# EAGLE schematic rs41 (EAGLE 9.6.2)

## Sheet 1 of 6: MCU
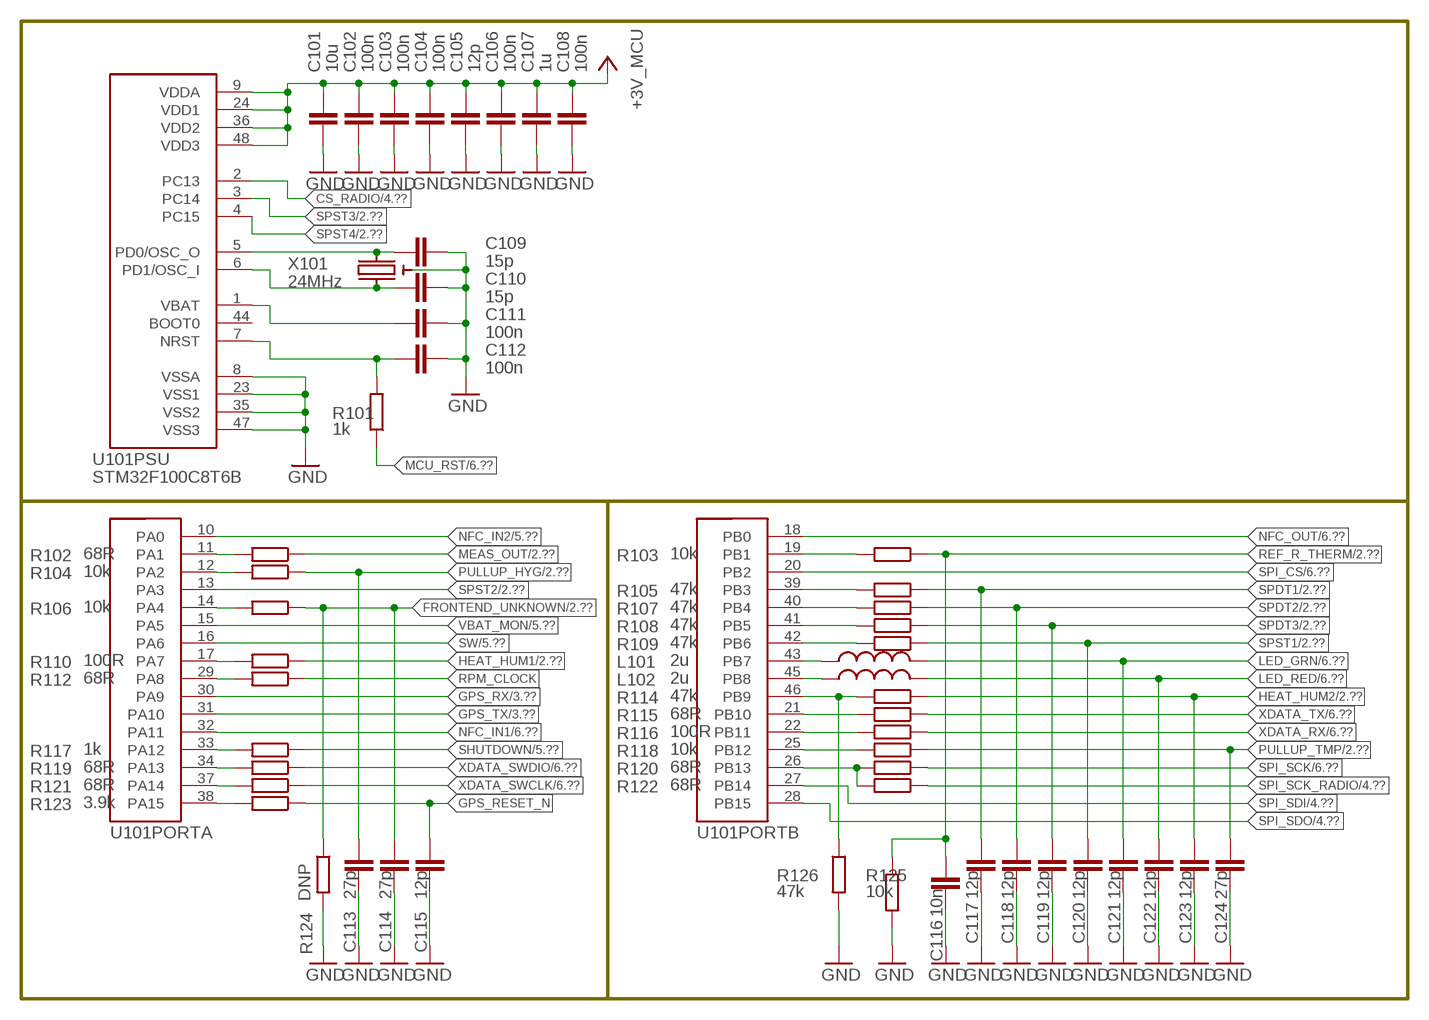
[diagram p0: schematic, sheet 1]

### Parts
C101  10u  C-EUC0603  [C0603]
C102  100n  C-EUC0402  [C0402]
C103  100n  C-EUC0402  [C0402]
C104  100n  C-EUC0402  [C0402]
C105  12p  C-EUC0402  [C0402]
C106  100n  C-EUC0402  [C0402]
C107  1u  C-EUC0402  [C0402]
C108  100n  C-EUC0402  [C0402]
C109  15p  C-EUC0402  [C0402]
C110  15p  C-EUC0402  [C0402]
C111  100n  C-EUC0402  [C0402]
C112  100n  C-EUC0402  [C0402]
C113  27p  C-EUC0402  [C0402]
C114  27p  C-EUC0402  [C0402]
C115  12p  C-EUC0402  [C0402]
C116  10n  C-EUC0402  [C0402]
C117  12p  C-EUC0402  [C0402]
C118  12p  C-EUC0402  [C0402]
C119  12p  C-EUC0402  [C0402]
C120  12p  C-EUC0402  [C0402]
C121  12p  C-EUC0402  [C0402]
C122  12p  C-EUC0402  [C0402]
C123  12p  C-EUC0402  [C0402]
C124  27p  C-EUC0402  [C0402]
L101  2u  L0402  [0402]
L102  2u  L0402  [0402]
R101  1k  R-EU_R0402  [R0402]
R102  68R  R-EU_R0402  [R0402]
R103  10k  R-EU_R0402  [R0402]
R104  10k  R-EU_R0402  [R0402]
R105  47k  R-EU_R0402  [R0402]
R106  10k  R-EU_R0402  [R0402]
R107  47k  R-EU_R0402  [R0402]
R108  47k  R-EU_R0402  [R0402]
R109  47k  R-EU_R0402  [R0402]
R110  100R  R-EU_R0402  [R0402]
R112  68R  R-EU_R0402  [R0402]
R114  47k  R-EU_R0402  [R0402]
R115  68R  R-EU_R0402  [R0402]
R116  100R  R-EU_R0402  [R0402]
R117  1k  R-EU_R0402  [R0402]
R118  10k  R-EU_R0402  [R0402]
R119  68R  R-EU_R0402  [R0402]
R120  68R  R-EU_R0402  [R0402]
R121  68R  R-EU_R0402  [R0402]
R122  68R  R-EU_R0402  [R0402]
R123  3.9k  R-EU_R0402  [R0402]
R124  DNP  R-EU_R0402  [R0402]
R125  10k  R-EU_R0402  [R0402]
R126  47k  R-EU_R0402  [R0402]
U101  STM32F100C8T6B  STM32F100C8LQFP48  [LQFP48]
X101  24MHz  OSC_MCU  [OSCCC650X400X120]

### Nets
+3V_MCU: C101.2 C102.2 C103.2 C104.2 C105.2 C106.2 C107.2 C108.2 U101.9(PSU:VDDA) U101.24(PSU:VDD1) U101.36(PSU:VDD2) U101.48(PSU:VDD3) ; also sheet 3,4,5,6
CS_RADIO: U101.2(PSU:PC13) ; also sheet 4
FRONTEND_UNKNOWN: C114.1 R106.1 R124.1 ; also sheet 2
GND: C101.1 C102.1 C103.1 C104.1 C105.1 C106.1 C107.1 C108.1 C109.2 C110.2 C111.2 C112.2 C113.2 C114.2 C115.2 C116.1 C117.1 C118.1 C119.1 C120.1 C121.1 C122.1 C123.1 C124.1 R124.2 R125.2 R126.2 U101.8(PSU:VSSA) U101.23(PSU:VSS1) U101.35(PSU:VSS2) U101.47(PSU:VSS3) X101.1(GND) X101.4(GND) ; also sheet 2,3,4,5,6
GPS_RESET_N: C115.1 R123.1
GPS_RX: U101.30(PORTA:PA9) ; also sheet 3
GPS_TX: U101.31(PORTA:PA10) ; also sheet 3
HEAT_HUM1: R110.1 ; also sheet 2
HEAT_HUM2: C123.2 R114.1 ; also sheet 2
LED_GRN: C121.2 L101.2 ; also sheet 6
LED_RED: C122.2 L102.2 ; also sheet 6
MCU_RST: R101.1 ; also sheet 6
MEAS_OUT: R102.1 ; also sheet 2
N$78: R121.2 U101.37(PORTA:PA14)
N$79: R119.2 U101.34(PORTA:PA13)
N$88: R117.2 U101.33(PORTA:PA12)
N$89: R112.2 U101.29(PORTA:PA8)
N$90: R110.2 U101.17(PORTA:PA7)
N$92: R102.2 U101.11(PORTA:PA1)
N$95: R104.2 U101.12(PORTA:PA2)
N$97: R123.2 U101.38(PORTA:PA15)
N$98: R106.2 U101.14(PORTA:PA4)
N$106: R115.2 U101.21(PORTB:PB10)
N$107: R116.2 U101.22(PORTB:PB11)
N$110: R118.2 U101.25(PORTB:PB12)
N$112: R120.2 R122.2 U101.26(PORTB:PB13)
N$115: R114.2 R126.1 U101.46(PORTB:PB9)
N$117: L102.1 U101.45(PORTB:PB8)
N$119: L101.1 U101.43(PORTB:PB7)
N$121: R109.2 U101.42(PORTB:PB6)
N$123: R108.2 U101.41(PORTB:PB5)
N$125: R107.2 U101.40(PORTB:PB4)
N$127: R105.2 U101.39(PORTB:PB3)
N$130: R103.2 U101.19(PORTB:PB1)
N$141: C109.1 U101.5(PSU:PD0/OSC_O) X101.2(XIN)
N$142: C110.1 U101.6(PSU:PD1/OSC_I) X101.3(XOUT)
N$143: C111.1 U101.1(PSU:VBAT)
N$144: C112.1 R101.2 U101.7(PSU:NRST)
NFC_IN1: U101.32(PORTA:PA11) ; also sheet 6
NFC_IN2: U101.10(PORTA:PA0) ; also sheet 5
NFC_OUT: U101.18(PORTB:PB0) ; also sheet 6
PULLUP_HYG: C113.1 R104.1 ; also sheet 2
PULLUP_TMP: C124.2 R118.1 ; also sheet 2
REF_R_THERM: C116.2 R103.1 R125.1 ; also sheet 2
RPM_CLOCK: R112.1
SHUTDOWN: R117.1 ; also sheet 5
SPDT1: C117.2 R105.1 ; also sheet 2
SPDT2: C118.2 R107.1 ; also sheet 2
SPDT3: C119.2 R108.1 ; also sheet 2
SPI_CS: U101.20(PORTB:PB2) ; also sheet 6
SPI_SCK: R120.1 ; also sheet 6
SPI_SCK_RADIO: R122.1 ; also sheet 4
SPI_SDI: U101.27(PORTB:PB14) ; also sheet 4,6
SPI_SDO: U101.28(PORTB:PB15) ; also sheet 4,6
SPST1: C120.2 R109.1 ; also sheet 2
SPST2: U101.13(PORTA:PA3) ; also sheet 2
SPST3: U101.3(PSU:PC14) ; also sheet 2
SPST4: U101.4(PSU:PC15) ; also sheet 2
SW: U101.16(PORTA:PA6) ; also sheet 5
VBAT_MON: U101.15(PORTA:PA5) ; also sheet 5
XDATA_RX: R116.1 ; also sheet 6
XDATA_SWCLK: R121.1 ; also sheet 6
XDATA_SWDIO: R119.1 ; also sheet 6
XDATA_TX: R115.1 ; also sheet 6
Unconnected: U101.44(PSU:BOOT0)

## Sheet 2 of 6: Frontend
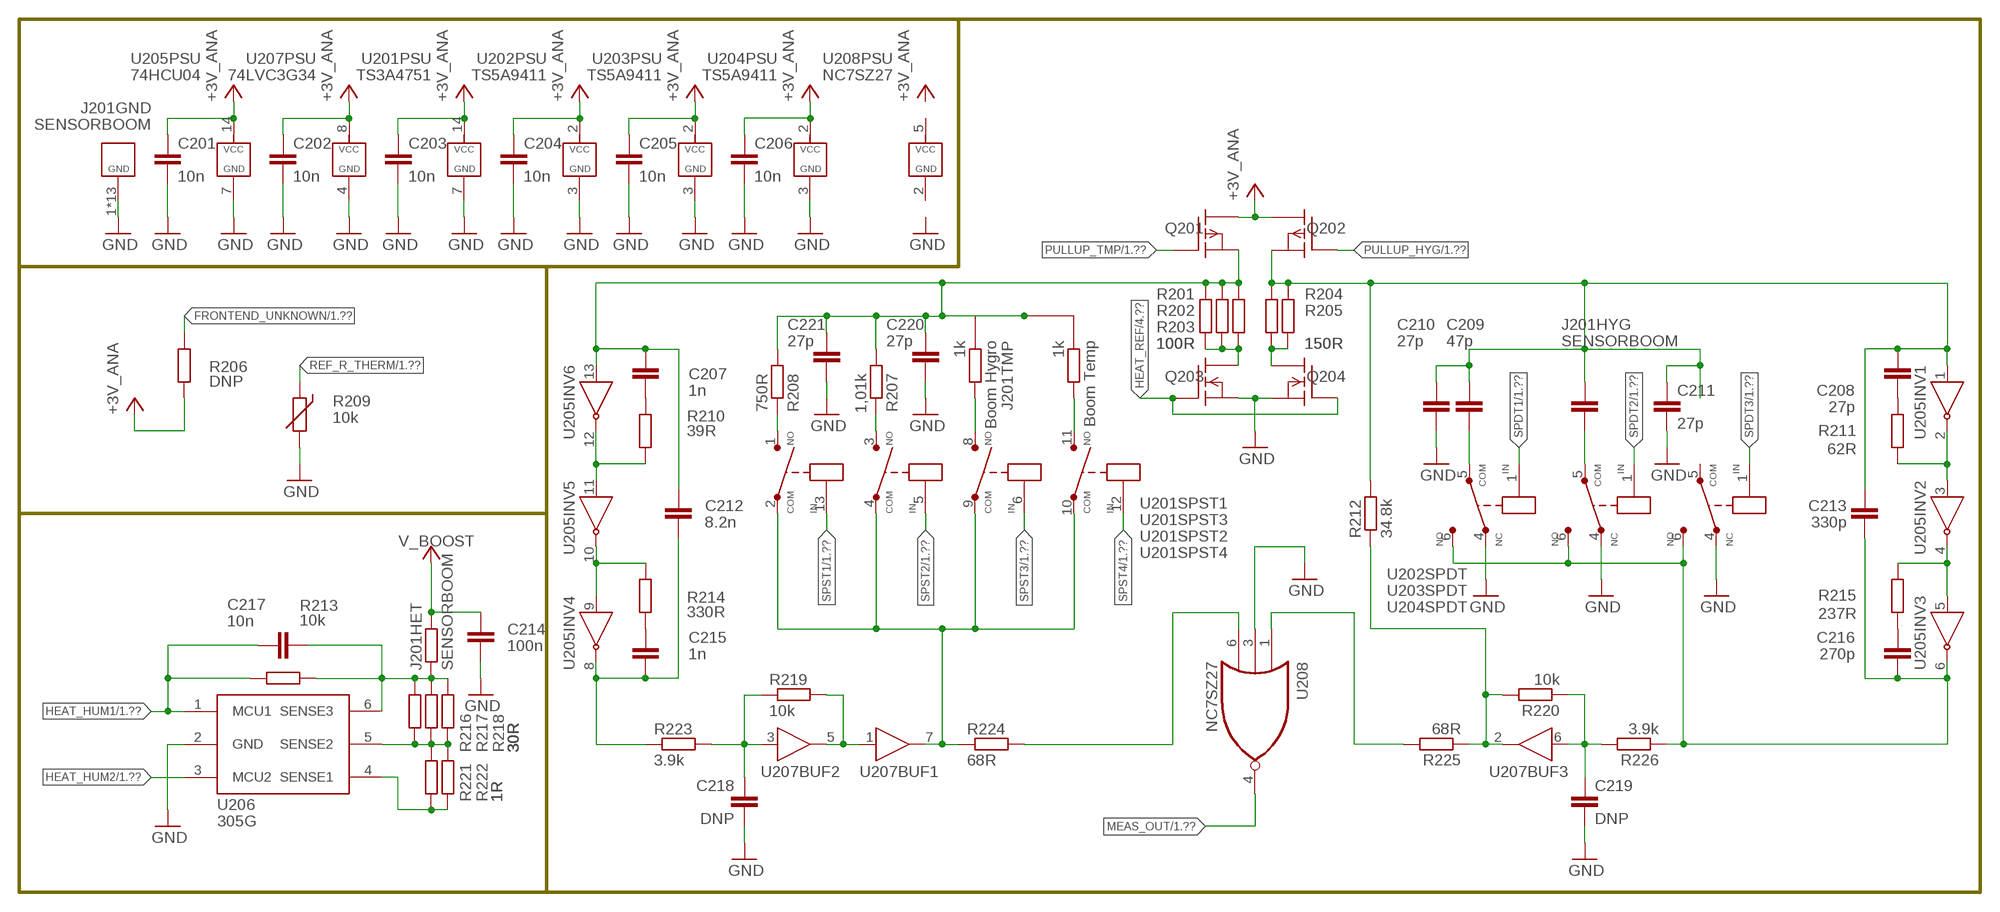
[diagram p1: schematic, sheet 2]

### Parts
C201  10n  C-EUC0402  [C0402]
C202  10n  C-EUC0402  [C0402]
C203  10n  C-EUC0402  [C0402]
C204  10n  C-EUC0402  [C0402]
C205  10n  C-EUC0402  [C0402]
C206  10n  C-EUC0402  [C0402]
C207  1n  C-EUC0402  [C0402]
C208  27p  C-EUC0402  [C0402]
C209  47p  C-EUC0603  [C0603]
C210  27p  C-EUC0402  [C0402]
C211  27p  C-EUC0402  [C0402]
C212  8.2n  C-EUC0603  [C0603]
C213  330p  C-EUC0402  [C0402]
C214  100n  C-EUC0402  [C0402]
C215  1n  C-EUC0402  [C0402]
C216  270p  C-EUC0402  [C0402]
C217  10n  C-EUC0402  [C0402]
C218  DNP  C-EUC0402  [C0402]
C219  DNP  C-EUC0402  [C0402]
C220  27p  C-EUC0402  [C0402]
C221  27p  C-EUC0402  [C0402]
J201  SENSORBOOM  [687316124422]
Q201  BSS92  [TO92]
Q202  BSS92  [TO92]
Q203  BSS101  [TO92]
Q204  BSS101  [TO92]
R201  100R  R-EU_R0603  [R0603]
R202  100R  R-EU_R0603  [R0603]
R203  100R  R-EU_R0603  [R0603]
R204  150R  R-EU_R0603  [R0603]
R205  150R  R-EU_R0603  [R0603]
R206  DNP  R-EU_R0402  [R0402]
R207  1,01k  R-EU_R0805  [R0805]
R208  750R  R-EU_R0805  [R0805]
R209  10k  THERMISTOR0402  [0402]
R210  39R  R-EU_R0402  [R0402]
R211  62R  R-EU_R0402  [R0402]
R212  34.8k  R-EU_R0402  [R0402]
R213  10k  R-EU_R0402  [R0402]
R214  330R  R-EU_R0402  [R0402]
R215  237R  R-EU_R0402  [R0402]
R216  30R  R-EU_R0603  [R0603]
R217  30R  R-EU_R0603  [R0603]
R218  30R  R-EU_R0603  [R0603]
R219  10k  R-EU_R0402  [R0402]
R220  10k  R-EU_R0402  [R0402]
R221  1R  R-EU_R0402  [R0402]
R222  1R  R-EU_R0402  [R0402]
R223  3.9k  R-EU_R0402  [R0402]
R224  68R  R-EU_R0402  [R0402]
R225  68R  R-EU_R0402  [R0402]
R226  3.9k  R-EU_R0402  [R0402]
U201  TS3A4751  [TSSOP14]
U202  TS5A9411  [SOT23-6]
U203  TS5A9411  [SOT23-6]
U204  TS5A9411  [SOT23-6]
U205  74HCU04  [TSSOP14]
U206  305G  [SOT23-6]
U207  74LVC3G34  [GHI-IC_VSSOP8(TI)]
U208  NC7SZ27  [SOT23-6]

### Nets
+3V_ANA: C201.1 C202.1 C203.1 C204.1 C205.1 C206.1 Q201.2(D) Q202.2(D) R206.2 U201.14(PSU:VCC) U202.2(PSU:VCC) U203.2(PSU:VCC) U204.2(PSU:VCC) U205.14(PSU:VCC) U207.8(PSU:VCC) ; also sheet 5
FRONTEND_UNKNOWN: R206.1 ; also sheet 1
GND: C201.2 C202.2 C203.2 C204.2 C205.2 C206.2 C210.2 C211.2 C214.2 C218.2 C219.2 C220.2 C221.2 J201.1(GND:GND) J201.3(GND:GND) J201.5(GND:GND) J201.7(GND:GND) J201.10(GND:GND) J201.12(GND:GND) J201.14(GND:GND) J201.15(GND:GND) J201.16(GND:GND) J201.Z1(GND:GND) J201.Z2(GND:GND) J201.Z3(GND:GND) J201.Z4(GND:GND) Q203.1(S) Q204.1(S) R209.2 U201.7(PSU:GND) U202.3(PSU:GND) U202.4(SPDT:NC) U203.3(PSU:GND) U203.4(SPDT:NC) U204.3(PSU:GND) U204.4(SPDT:NC) U205.7(PSU:GND) U206.2(GND) U207.4(PSU:GND) U208.3(B) ; also sheet 1,3,4,5,6
HEAT_HUM1: C217.1 R213.2 U206.1(MCU1) ; also sheet 1
HEAT_HUM2: U206.3(MCU2) ; also sheet 1
HEAT_REF: Q203.2(G) Q204.2(G) ; also sheet 4
MEAS_OUT: U208.4(Y) ; also sheet 1
N$2: Q204.3(D) R204.1 R205.1
N$3: R225.2 U208.1(A)
N$4: R224.2 U208.6(C)
N$5: C209.2 U202.5(SPDT:COM)
N$6: J201.6 U203.5(SPDT:COM)
N$7: Q203.3(D) R201.1 R202.1 R203.1
N$8: C212.2 C215.2 R223.1 U205.8(INV4:Y)
N$9: C207.2 R210.1
N$10: C207.1 C212.1 C220.1 C221.1 J201.13(TMP:TEMP_COM) Q201.3(S) R201.2 R202.2 R203.2 R207.1 R208.1 U205.13(INV6:A)
N$11: R210.2 U205.11(INV5:A) U205.12(INV6:Y)
N$12: R214.1 U205.9(INV4:A) U205.10(INV5:Y)
N$13: R224.1 U201.2(SPST1:COM) U201.4(SPST2:COM) U201.9(SPST3:COM) U201.10(SPST4:COM) U207.7(BUF1:Y)
N$14: C208.2 R211.2
N$15: C216.1 R215.1
N$16: R221.1 R222.1 U206.4(SENSE1)
N$17: C215.1 R214.2
N$18: R215.2 U205.4(INV2:Y) U205.5(INV3:A)
N$19: R211.1 U205.2(INV1:Y) U205.3(INV2:A)
N$20: C218.1 R219.1 R223.2 U207.3(BUF2:A)
N$21: R219.2 U207.1(BUF1:A) U207.5(BUF2:Y)
N$22: C219.1 R220.1 R226.2 U207.6(BUF3:A)
N$23: R212.1 R220.2 R225.1 U207.2(BUF3:Y)
N$24: R216.1 R217.1 R218.1 R221.2 R222.2 U206.5(SENSE2)
N$25: R208.2 U201.1(SPST1:NO)
N$26: R207.2 U201.3(SPST2:NO)
N$27: J201.2(TMP:TEMP) U201.11(SPST4:NO)
N$28: J201.11(TMP:HYG_TEMP) U201.8(SPST3:NO)
N$30: C217.2 J201.8 R213.1 R216.2 R217.2 R218.2 U206.6(SENSE3)
N$34: C208.1 C209.1 C210.1 C211.1 C213.1 J201.4 Q202.3(S) R204.2 R205.2 R212.2 U205.1(INV1:A)
N$39: C213.2 C216.2 R226.1 U202.6(SPDT:NO) U203.6(SPDT:NO) U204.6(SPDT:NO) U205.6(INV3:Y)
PULLUP_HYG: Q202.1(G) ; also sheet 1
PULLUP_TMP: Q201.1(G) ; also sheet 1
REF_R_THERM: R209.1 ; also sheet 1
SPDT1: U202.1(SPDT:IN) ; also sheet 1
SPDT2: U203.1(SPDT:IN) ; also sheet 1
SPDT3: U204.1(SPDT:IN) ; also sheet 1
SPST1: U201.13(SPST1:IN) ; also sheet 1
SPST2: U201.5(SPST2:IN) ; also sheet 1
SPST3: U201.6(SPST3:IN) ; also sheet 1
SPST4: U201.12(SPST4:IN) ; also sheet 1
V_BOOST: C214.1 J201.9 ; also sheet 5,6
Unconnected: U204.5(SPDT:COM) U208.2(GND) U208.5(VCC)

## Sheet 3 of 6: GPS
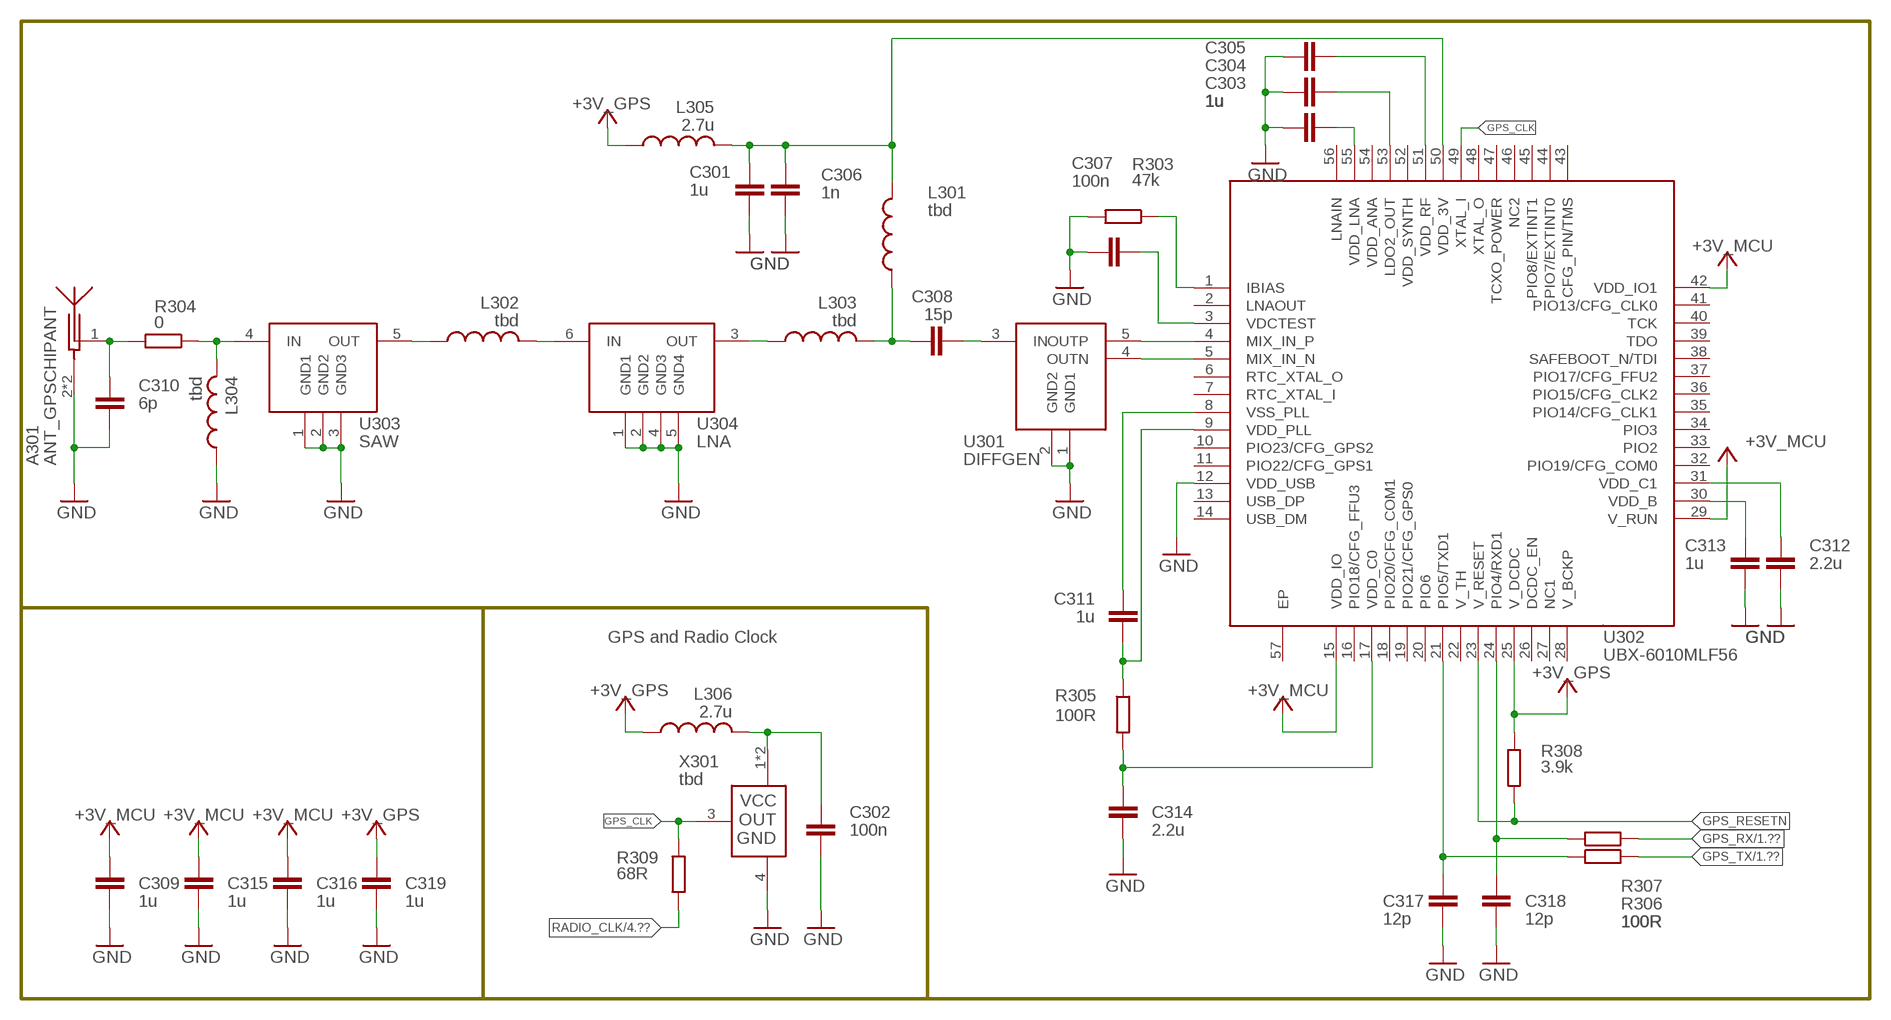
[diagram p2: schematic, sheet 3]

### Parts
A301  ANT_GPSCHIPANT  [DFN100X60X40-3]
C301  1u  C-EUC0402  [C0402]
C302  100n  C-EUC0402  [C0402]
C303  1u  C-EUC0402  [C0402]
C304  1u  C-EUC0402  [C0402]
C305  1u  C-EUC0402  [C0402]
C306  1n  C-EUC0402  [C0402]
C307  100n  C-EUC0402  [C0402]
C308  15p  C-EUC0402  [C0402]
C309  1u  C-EUC0402  [C0402]
C310  6p  C-EUC0402  [C0402]
C311  1u  C-EUC0402  [C0402]
C312  2.2u  C-EUC0603  [C0603]
C313  1u  C-EUC0402  [C0402]
C314  2.2u  C-EUC0603  [C0603]
C315  1u  C-EUC0402  [C0402]
C316  1u  C-EUC0402  [C0402]
C317  12p  C-EUC0402  [C0402]
C318  12p  C-EUC0402  [C0402]
C319  1u  C-EUC0402  [C0402]
L301  tbd  L0402  [0402]
L302  tbd  L0402  [0402]
L303  tbd  L0402  [0402]
L304  tbd  L0402  [0402]
L305  2.7u  L0402  [0402]
L306  2.7u  L0402  [0402]
R303  47k  R-EU_R0402  [R0402]
R304  0  R-EU_R0402  [R0402]
R305  100R  R-EU_R0402  [R0402]
R306  100R  R-EU_R0402  [R0402]
R307  100R  R-EU_R0402  [R0402]
R308  3.9k  R-EU_R0402  [R0402]
R309  68R  R-EU_R0402  [R0402]
U301  DIFFGEN  [SOT23-5]
U302  UBX-6010MLF56  [QFN56_0.5MM]
U303  SAW  [SOT23-5]
U304  LNA  [SOT23-6]
X301  tbd  OSC_GPSXTAL4  [OSCCC650X400X120]

### Nets
+3V_GPS: C319.2 L305.1 L306.1 R308.1 U302.25(V_DCDC) ; also sheet 5
+3V_MCU: C309.2 C315.2 C316.1 U302.15(VDD_IO) U302.29(V_RUN) U302.42(VDD_IO1) ; also sheet 1,4,5,6
GND: A301.2(GND) A301.3(GND) C301.2 C302.2 C303.1 C304.1 C305.1 C306.2 C307.2 C309.1 C310.2 C312.1 C313.1 C314.1 C315.1 C316.2 C317.1 C318.1 C319.1 L304.1 R303.2 U301.1(GND1) U301.2(GND2) U302.12(VDD_USB) U303.1(GND1) U303.2(GND2) U303.3(GND3) U304.1(GND1) U304.2(GND2) U304.4(GND3) U304.5(GND4) X301.4(VCC) ; also sheet 1,2,4,5,6
GPS_CLK: R309.2 U302.49(XTAL_I) X301.3(OUT)
GPS_RESETN: R308.2 U302.23(V_RESET)
GPS_RX: R307.2 ; also sheet 1
GPS_TX: R306.2 ; also sheet 1
LNA_PW: C301.1 C306.1 L301.2 L305.2 U302.50(VDD_3V)
N$36: C314.2 R305.2 U302.17(VDD_C0)
N$40: R303.1 U302.1(IBIAS)
N$41: C307.1 U302.3(VDCTEST)
N$42: U301.5(OUTP) U302.4(MIX_IN_P)
N$43: U301.4(OUTN) U302.5(MIX_IN_N)
N$44: C311.2 U302.8(VSS_PLL)
N$45: C311.1 R305.1 U302.9(VDD_PLL)
N$46: C317.2 R306.1 U302.21(PIO5/TXD1)
N$48: C308.2 U301.3(IN)
N$50: C308.1 L301.1 L303.2
N$52: L303.1 U304.3(OUT)
N$55: C313.2 U302.30(VDD_B)
N$56: L302.2 U304.6(IN)
N$57: L302.1 U303.5(OUT)
N$58: L304.2 R304.1 U303.4(IN)
N$59: A301.1(ANT) C310.1 R304.2
N$60: C312.2 U302.31(VDD_C1)
N$61: C303.2 U302.55(VDD_LNA)
N$62: C304.2 U302.53(LDO2_OUT)
N$63: C305.2 U302.51(VDD_RF)
N$64: C302.1 L306.2 X301.1(GND1) X301.2(GND1)
N$67: C318.2 R307.1 U302.24(PIO4/RXD1)
RADIO_CLK: R309.1 ; also sheet 4
Unconnected: U302.2(LNAOUT) U302.6(RTC_XTAL_O) U302.7(RTC_XTAL_I) U302.10(PIO23/CFG_GPS2) U302.11(PIO22/CFG_GPS1) U302.13(USB_DP) U302.14(USB_DM) U302.16(PIO18/CFG_FFU3) U302.18(PIO20/CFG_COM1) U302.19(PIO21/CFG_GPS0) U302.20(PIO6) U302.22(V_TH) U302.26(DCDC_EN) U302.27(NC1) U302.28(V_BCKP) U302.32(PIO19/CFG_COM0) U302.33(PIO2) U302.34(PIO3) U302.35(PIO14/CFG_CLK1) U302.36(PIO15/CFG_CLK2) U302.37(PIO17/CFG_FFU2) U302.38(SAFEBOOT_N/TDI) U302.39(TDO) U302.40(TCK) U302.41(PIO13/CFG_CLK0) U302.43(CFG_PIN/TMS) U302.44(PIO7/EXTINT0) U302.45(PIO8/EXTINT1) U302.46(NC2) U302.47(TCXO_POWER) U302.48(XTAL_O) U302.52(VDD_SYNTH) U302.54(VDD_ANA) U302.56(LNAIN) U302.57(EP)

### Notes on the sheet
- GPS and Radio Clock

## Sheet 4 of 6: Radio
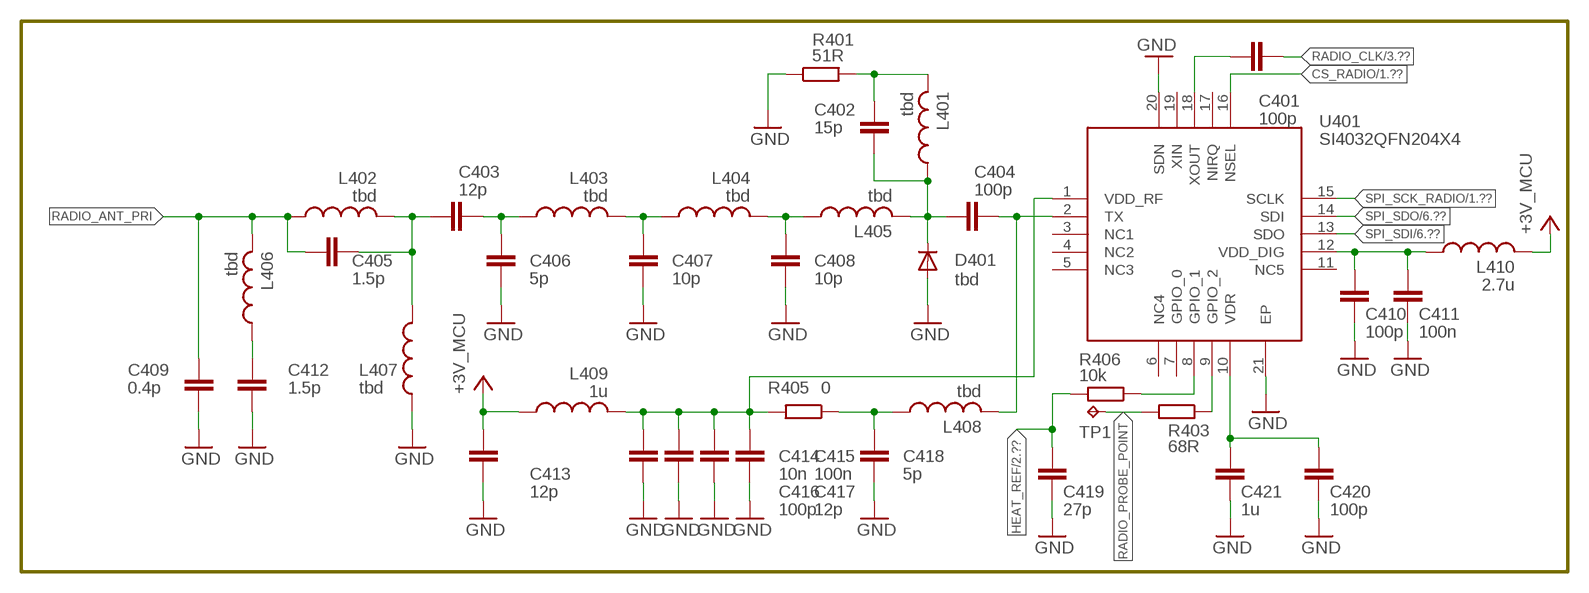
[diagram p3: schematic, sheet 4]

### Parts
C401  100p  C-EUC0402  [C0402]
C402  15p  C-EUC0402  [C0402]
C403  12p  C-EUC0402  [C0402]
C404  100p  C-EUC0402  [C0402]
C405  1.5p  C-EUC0402  [C0402]
C406  5p  C-EUC0402  [C0402]
C407  10p  C-EUC0402  [C0402]
C408  10p  C-EUC0402  [C0402]
C409  0.4p  C-EUC0402  [C0402]
C410  100p  C-EUC0402  [C0402]
C411  100n  C-EUC0402  [C0402]
C412  1.5p  C-EUC0402  [C0402]
C413  12p  C-EUC0402  [C0402]
C414  10n  C-EUC0603  [C0603]
C415  100n  C-EUC0402  [C0402]
C416  100p  C-EUC0402  [C0402]
C417  12p  C-EUC0402  [C0402]
C418  5p  C-EUC0402  [C0402]
C419  27p  C-EUC0402  [C0402]
C420  100p  C-EUC0402  [C0402]
C421  1u  C-EUC0402  [C0402]
D401  tbd  1N4004  [DO41-10]
L401  tbd  L0402  [0402]
L402  tbd  L0402  [0402]
L403  tbd  L0402  [0402]
L404  tbd  L0402  [0402]
L405  tbd  L0402  [0402]
L406  tbd  L0402  [0402]
L407  tbd  L0402  [0402]
L408  tbd  L0402  [0402]
L409  1u  L0402  [0402]
L410  2.7u  L0402  [0402]
R401  51R  R-EU_R0402  [R0402]
R403  68R  R-EU_R0402  [R0402]
R405  0  R-EU_R0402  [R0402]
R406  10k  R-EU_R0402  [R0402]
TP1  TPPAD1-13  [P1-13]
U401  SI4032QFN204X4  [QFN20_0.5MM]

### Nets
+3V_MCU: C413.1 L409.1 L410.2 ; also sheet 1,3,5,6
CS_RADIO: U401.16(NSEL) ; also sheet 1
GND: C406.2 C407.2 C408.2 C409.1 C410.2 C411.2 C412.2 C413.2 C414.2 C415.2 C416.2 C417.2 C418.2 C419.2 C420.2 C421.2 D401.A L407.1 R401.1 U401.20(SDN) U401.21(EP) ; also sheet 1,2,3,5,6
HEAT_REF: C419.1 R406.2 ; also sheet 2
N$29: C403.1 C405.2 L402.2 L407.2
N$53: C412.1 L406.1
N$71: C401.1 U401.18(XOUT)
N$73: C410.1 C411.1 L410.1 U401.12(VDD_DIG)
N$74: C420.1 C421.1 U401.10(VDR)
N$75: C414.1 C415.1 C416.1 C417.1 L409.2 R405.2 U401.1(VDD_RF)
N$76: R406.1 U401.8(GPIO_1)
N$77: R403.1 U401.9(GPIO_2)
N$80: C418.1 L408.1 R405.1
N$82: C404.2 L408.2 U401.2(TX)
N$83: C403.2 C406.1 L403.1
N$84: C407.1 L403.2 L404.1
N$85: C408.1 L404.2 L405.1
N$86: C402.2 C404.1 D401.C L401.1 L405.2
N$87: C402.1 L401.2 R401.2
RADIO_ANT_PRI: C405.1 C409.2 L402.1 L406.2
RADIO_CLK: C401.2 ; also sheet 3
RADIO_PROBE_POINT: R403.2 TP1.TP
SPI_SCK_RADIO: U401.15(SCLK) ; also sheet 1
SPI_SDI: U401.13(SDO) ; also sheet 1,6
SPI_SDO: U401.14(SDI) ; also sheet 1,6
Unconnected: U401.3(NC1) U401.4(NC2) U401.5(NC3) U401.6(NC4) U401.7(GPIO_0) U401.11(NC5) U401.17(NIRQ) U401.19(XIN)

## Sheet 5 of 6: PSU
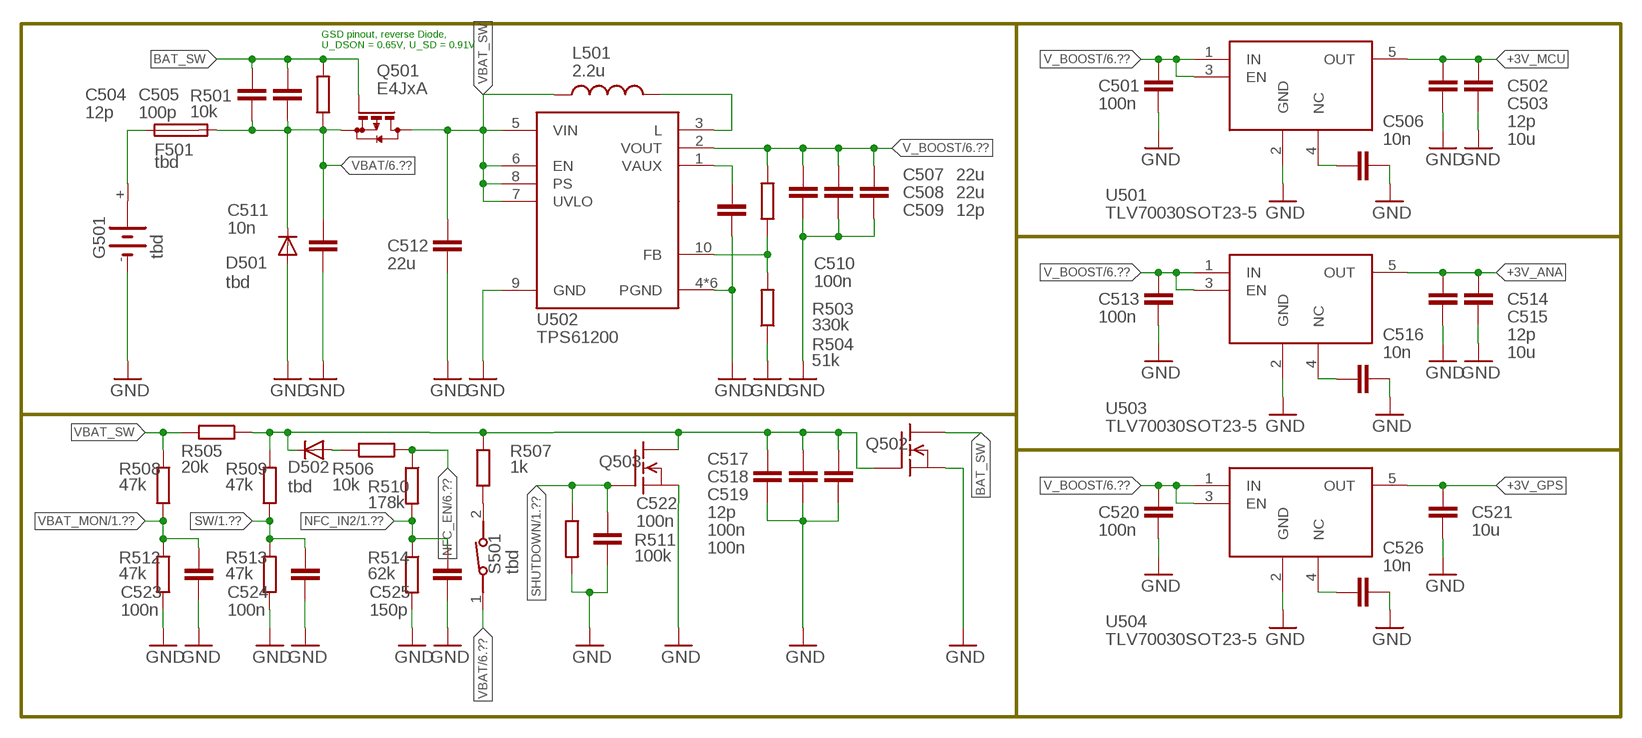
[diagram p4: schematic, sheet 5]

### Parts
C501  100n  C-EUC0402  [C0402]
C502  12p  C-EUC0402  [C0402]
C503  10u  C-EUC0603  [C0603]
C504  12p  C-EUC0402  [C0402]
C505  100p  C-EUC0402  [C0402]
C506  10n  C-EUC0402  [C0402]
C507  22u  C-EUC0805  [C0805]
C508  22u  C-EUC0805  [C0805]
C509  12p  C-EUC0402  [C0402]
C510  100n  C-EUC0402  [C0402]
C511  10n  C-EUC0402  [C0402]
C512  22u  C-EUC0805  [C0805]
C513  100n  C-EUC0402  [C0402]
C514  12p  C-EUC0402  [C0402]
C515  10u  C-EUC0603  [C0603]
C516  10n  C-EUC0402  [C0402]
C517  12p  C-EUC0402  [C0402]
C518  100n  C-EUC0402  [C0402]
C519  100n  C-EUC0402  [C0402]
C520  100n  C-EUC0402  [C0402]
C521  10u  C-EUC0603  [C0603]
C522  100n  C-EUC0402  [C0402]
C523  100n  C-EUC0402  [C0402]
C524  100n  C-EUC0402  [C0402]
C525  150p  C-EUC0402  [C0402]
C526  10n  C-EUC0402  [C0402]
D501  tbd  1N4004  [DO41-10]
D502  tbd  1N4004  [DO41-10]
F501  tbd  FUSE  [R0805]
G501  tbd  2V60R  [2V60R]
L501  2.2u  LWE3816  [L_WE3816]
Q501  E4JxA  BSS84  [SOT23]
Q502  BSS101  [TO92]
Q503  BSS101  [TO92]
R501  10k  R-EU_R0402  [R0402]
R503  330k  R-EU_R0402  [R0402]
R504  51k  R-EU_R0402  [R0402]
R505  20k  R-EU_R0402  [R0402]
R506  10k  R-EU_R0402  [R0402]
R507  1k  R-EU_R0402  [R0402]
R508  47k  R-EU_R0402  [R0402]
R509  47k  R-EU_R0402  [R0402]
R510  178k  R-EU_R0402  [R0402]
R511  100k  R-EU_R0402  [R0402]
R512  47k  R-EU_R0402  [R0402]
R513  47k  R-EU_R0402  [R0402]
R514  62k  R-EU_R0402  [R0402]
S501  tbd  434121043816  [434121043816]
U501  TLV70030SOT23-5  [SOT23-5]
U502  TPS61200  [QFN14_0.5MM_TH]
U503  TLV70030SOT23-5  [SOT23-5]
U504  TLV70030SOT23-5  [SOT23-5]

### Nets
+3V_ANA: C514.1 C515.1 U503.5(OUT) ; also sheet 2
+3V_GPS: C521.1 U504.5(OUT) ; also sheet 3
+3V_MCU: C502.1 C503.1 U501.5(OUT) ; also sheet 1,3,4,6
BAT_SW: C504.1 C505.1 Q501.1(G) Q502.3(D) R501.2
GND: C501.2 C502.2 C503.2 C506.2 C507.2 C508.2 C509.2 C510.2 C511.2 C512.2 C513.2 C514.2 C515.2 C516.2 C517.2 C518.2 C519.2 C520.2 C521.2 C522.2 C523.2 C524.2 C525.2 C526.2 D501.A G501.- Q502.1(S) Q503.1(S) R504.1 R511.2 R512.1 R513.1 R514.2 U501.2(GND) U502.4(PGND) U502.9(GND) U502.TH1(PGND) U502.TH2(PGND) U502.TH3(PGND) U502.TH4(PGND) U502.TH5(PGND) U503.2(GND) U504.2(GND) ; also sheet 1,2,3,4,6
N$1: C506.1 U501.4(NC)
N$31: C516.1 U503.4(NC)
N$32: L501.2 U502.3(L)
N$33: C526.1 U504.4(NC)
N$35: F501.1 G501.+
N$37: C510.1 U502.1(VAUX)
N$38: R503.1 R504.2 U502.10(FB)
N$47: R507.2 S501.2
N$49: C517.1 C518.1 C519.1 D502.C Q502.2(G) Q503.3(D) R505.1 R507.1 R509.2
N$51: D502.A R506.2
NFC_EN: R506.1 R510.1 ; also sheet 6
NFC_IN2: C525.1 R510.2 R514.1 ; also sheet 1
SHUTDOWN: C522.1 Q503.2(G) R511.1 ; also sheet 1
SW: C524.1 R509.1 R513.2 ; also sheet 1
V_BOOST: C501.1 C507.1 C508.1 C509.1 C513.1 C520.1 R503.2 U501.1(IN) U501.3(EN) U502.2(VOUT) U503.1(IN) U503.3(EN) U504.1(IN) U504.3(EN) ; also sheet 2,6
VBAT: C504.2 C505.2 C511.1 D501.C F501.2 Q501.2(S) R501.1 S501.1 ; also sheet 6
VBAT_MON: C523.1 R508.1 R512.2 ; also sheet 1
VBAT_SW: C512.1 L501.1 Q501.3(D) R505.2 R508.2 U502.5(VIN) U502.6(EN) U502.7(UVLO) U502.8(PS)
Unconnected: G501.+@1(+)

### Notes on the sheet
- GSD pinout, reverse Diode,
  U_DSON = 0.65V, U_SD = 0.91V

## Sheet 6 of 6: Interface
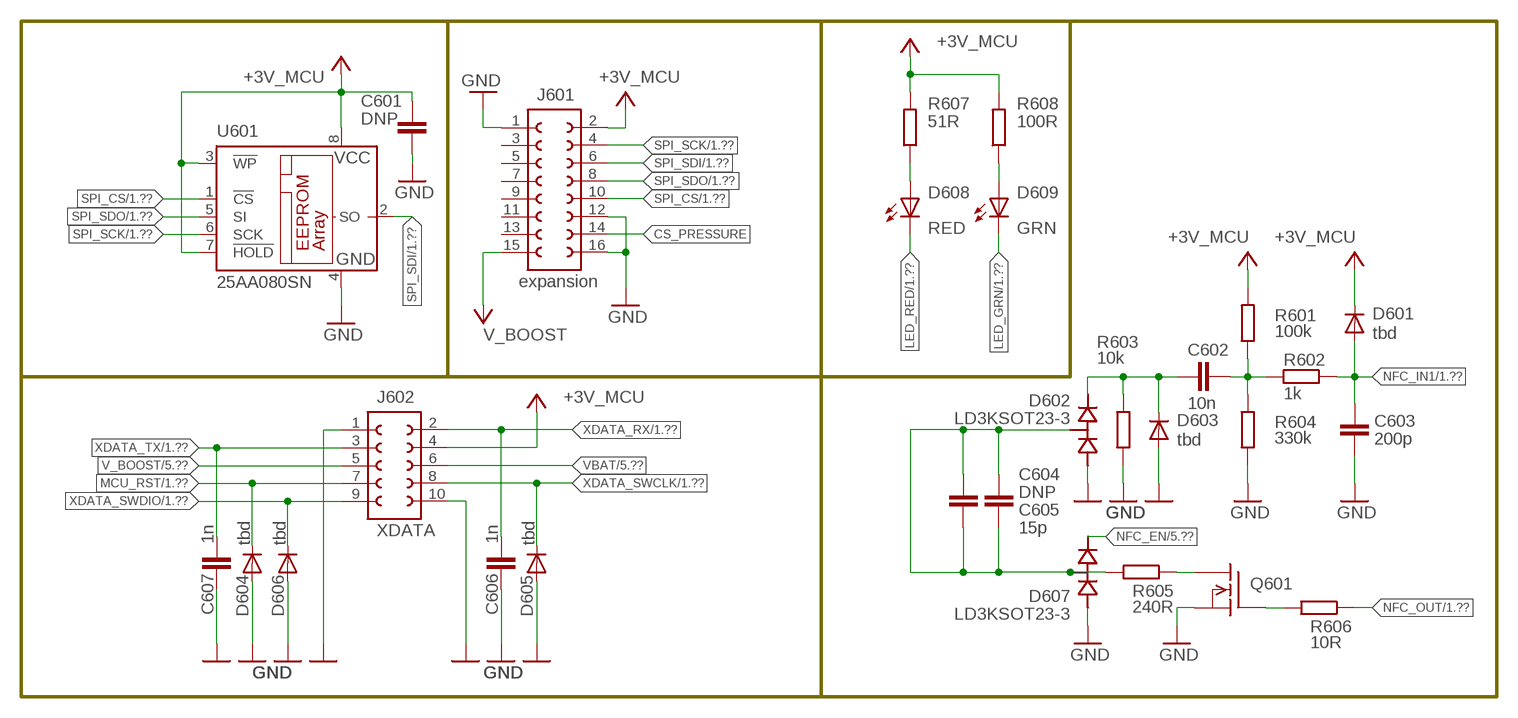
[diagram p5: schematic, sheet 6]

### Parts
C601  DNP  C-EUC0402  [C0402]
C602  10n  C-EUC0402  [C0402]
C603  200p  C-EUC0402  [C0402]
C604  DNP  C-EUC0402  [C0402]
C605  15p  C-EUC0402  [C0402]
C606  1n  C-EUC0402  [C0402]
C607  1n  C-EUC0402  [C0402]
D601  tbd  1N4004  [DO41-10]
D602  LD3KSOT23-3  [SOT23-3]
D603  tbd  1N4004  [DO41-10]
D604  tbd  1N4004  [DO41-10]
D605  tbd  1N4004  [DO41-10]
D606  tbd  1N4004  [DO41-10]
D607  LD3KSOT23-3  [SOT23-3]
D608  RED  LEDCHIPLED_0603  [CHIPLED_0603]
D609  GRN  LEDCHIPLED_0603  [CHIPLED_0603]
J601  expansion  62001621121  [62001621121]
J602  XDATA  62001021121  [62001021121]
Q601  BSS101  [TO92]
R601  100k  R-EU_R0402  [R0402]
R602  1k  R-EU_R0402  [R0402]
R603  10k  R-EU_R0402  [R0402]
R604  330k  R-EU_R0402  [R0402]
R605  240R  R-EU_R0402  [R0402]
R606  10R  R-EU_R0402  [R0402]
R607  51R  R-EU_R0402  [R0402]
R608  100R  R-EU_R0402  [R0402]
U601  25AA080SN  [SO-08]

### Nets
+3V_MCU: C601.1 D601.C J601.2 J602.4 R601.2 R607.2 R608.2 U601.3(!WP) U601.7(!HOLD) U601.8(VCC) ; also sheet 1,3,4,5
CS_PRESSURE: J601.14
GND: C601.2 C603.1 C606.1 C607.1 D602.1(A) D603.A D604.A D605.A D606.A D607.1(A) J601.1 J601.12 J601.16 J602.1 J602.10 Q601.1(S) R603.1 R604.1 U601.4(GND) ; also sheet 1,2,3,4,5
LED_GRN: D609.C ; also sheet 1
LED_RED: D608.C ; also sheet 1
MCU_RST: D604.C J602.7 ; also sheet 1
N$66: C602.1 D602.2(K) D603.C R603.2
N$68: C604.1 C604.2 C605.1 C605.2 D602.3(M) D607.3(M) R605.2
N$69: C602.2 R601.1 R602.2 R604.2
N$70: D609.A R608.1
N$72: Q601.3(D) R605.1
N$93: D608.A R607.1
N$94: Q601.2(G) R606.2
NFC_EN: D607.2(K) ; also sheet 5
NFC_IN1: C603.2 D601.A R602.1 ; also sheet 1
NFC_OUT: R606.1 ; also sheet 1
SPI_CS: J601.10 U601.1(!CS) ; also sheet 1
SPI_SCK: J601.4 U601.6(SCK) ; also sheet 1
SPI_SDI: J601.6 U601.2(SO) ; also sheet 1,4
SPI_SDO: J601.8 U601.5(SI) ; also sheet 1,4
V_BOOST: J601.15 J602.5 ; also sheet 2,5
VBAT: J602.6 ; also sheet 5
XDATA_RX: C606.2 J602.2 ; also sheet 1
XDATA_SWCLK: D605.C J602.8 ; also sheet 1
XDATA_SWDIO: D606.C J602.9 ; also sheet 1
XDATA_TX: C607.2 J602.3 ; also sheet 1
Unconnected: J601.3 J601.5 J601.7 J601.9 J601.11 J601.13

## Library data of the parts
A301 = rs41:ANT_GPS
C101-C124 C201-C221 C301-C319 C401-C421 C501-C526 C601-C607 = rcl:C-EU: CAPACITOR, European symbol; SPICEPREFIX: C
D401 D501 D502 D601 D603-D606 = diode:1N4004: DIODE general purpose rectifier, 1 A
D602 D607 = rs41:LD3K
D608 D609 = led:LED: LED OSRAM: - CHIPLED LG R971, LG N971, LY N971, LG Q971, LY Q971, LO R971, LY R971 LH N974, LH R974 LS Q976, LO Q976, LY Q976 LO Q996 - Hyper CHIPLED LW Q18S LB Q993, LB Q99A, LB R99A - SideLED LS A670, LO A670, LY A670, LG A670, LP A670 LB A673, LV A673, LT A673, LW A673 LH A674 LY A675 LS A676, LA A676, LO A676, LY A676, LW A676 LS A679, LY A679, LG A679 - Hyper Micro SIDELED® LS Y876, LA Y876, LO Y876, LY Y876 LT Y87S - SmartLED LW L88C, LW L88S LB L89C, LB L89S, LG L890 LS L89K, LO L89K, LY L89K LS L896, LA L896, LO L896, LY L896 - TOPLED LS T670, LO T670, LY T670, LG T670, LP T670 LSG T670, LSP T670, LSY T670, LOP T670, LYG T670 LG T671, LOG T671, LSG T671 LB T673, LV T673, LT T673, LW T673 LH T674 LS T676, LA T676, LO T676, LY T676, LB T676, LH T676, LSB T676, LW T676 LB T67C, LV T67C, LT T67C, LS T67K, LO T67K, LY T67K, LW E67C LS E67B, LA E67B, LO E67B, LY E67B, LB E67C, LV E67C, LT E67C LW T67C LS T679, LY T679, LG T679 LS T770, LO T770, LY T770, LG T770, LP T770 LB T773, LV T773, LT T773, LW T773 LH T774 LS E675, LA E675, LY E675, LS T675 LS T776, LA T776, LO T776, LY T776, LB T776 LHGB T686 LT T68C, LB T68C - Hyper Mini TOPLED® LB M676 - Mini TOPLED Santana® LG M470 LS M47K, LO M47K, LY M47K Source: http://www.osram.convergy.de LUXEON: - LUMILED® LXK2-PW12-R00, LXK2-PW12-S00, LXK2-PW14-U00, LXK2-PW14-V00 LXK2-PM12-R00, LXK2-PM12-S00, LXK2-PM14-U00 LXK2-PE12-Q00, LXK2-PE12-R00, LXK2-PE12-S00, LXK2-PE14-T00, LXK2-PE14-U00 LXK2-PB12-K00, LXK2-PB12-L00, LXK2-PB12-M00, LXK2-PB14-N00, LXK2-PB14-P00, LXK2-PB14-Q00 LXK2-PR12-L00, LXK2-PR12-M00, LXK2-PR14-Q00, LXK2-PR14-R00 LXK2-PD12-Q00, LXK2-PD12-R00, LXK2-PD12-S00 LXK2-PH12-R00, LXK2-PH12-S00 LXK2-PL12-P00, LXK2-PL12-Q00, LXK2-PL12-R00 Source: www.luxeon.com KINGBRIGHT: KA-3528ASYC Source: www.kingbright.com
F501 = rs41:FUSE
G501 = battery:2V60R: NC ACCU Varta
J201 = rs41:SENSORBOOM
J601 = Board-to-Board (rev17e):62001621121: WR-PHD 2.00mm Dual Pin Header, 16 Pins=>Code : WR-PHD_Dual_Pin_Header_62001621121 <http://katalog.we-online.de/media/images/eican/WR-PHD_Dual_Pin_Header_6200xx21121.jpg> Details see: http://katalog.we-online.de/en/em/620_0xx_211_21 Created 2014-06-03, Karrer Zheng 2014 (C) Würth Elektronik
J602 = Board-to-Board (rev17e):62001021121: WR-PHD 2.00mm Dual Pin Header, 10 Pins=>Code : WR-PHD_Dual_Pin_Header_62001021121 <http://katalog.we-online.de/media/images/eican/WR-PHD_Dual_Pin_Header_6200xx21121.jpg> Details see: http://katalog.we-online.de/en/em/620_0xx_211_21 Created 2014-06-03, Karrer Zheng 2014 (C) Würth Elektronik
L101 L102 L301-L306 L401-L410 L501 = rs41:L
Q201 Q202 = transistor-fet:BSS92: P-Channel Enhancement MOSFET -200V; -0,15A; 11Ohm
Q203 Q204 Q502 Q503 Q601 = transistor-fet:BSS101: N-Channel Enhancement MOSFET 200V; 0,16A; 11Ohm
Q501 = transistor-small-signal:BSS84: P-CHANNEL MOS FET
R101-R110 R112 R114-R126 R201-R208 R210-R226 R303-R309 R401 R403 R405 R406 R501 R503-R514 R601-R608 = rcl:R-EU_: RESISTOR, European symbol; SPICEPREFIX: R
R209 = rs41:THERMISTOR
S501 = Wurth_Elektronik_Electromechanic_Switch_rev17c:434121043816: 6.0x3.5 mm SMD WS-TASV <http://katalog.we-online.de/media/images/v2/Family_WS-TASV_6.0x3.jpg> Details see: http://katalog.we-online.de/em/datasheet/4341x1xxx8x6.pdf 2015 (C) Wurth Elektronik
TP1 = testpad:TP: Test pad
U101 = rs41:STM32F100C8
U201 = rs41:TS3A4751
U202-U204 = rs41:TS5A9411
U205 = rs41:74HCU04
U206 = rs41:305G
U207 = rs41:74LVC3G34
U208 = rs41:NC7SZ27; DATASHEET: https://www.onsemi.com/pdf/datasheet/nc7sz27-d.pdf
U301 = rs41:DIFFGEN
U302 = rs41:UBX-6010
U303 = rs41:SAW
U304 = rs41:LNA
U401 = rs41:SI4032
U501 U503 U504 = rs41:TLV70030
U502 = rs41:TPS61200
U601 = microchip:25*: Serial EEPROM 4K/ 8K , SPI bus; MF: MICROCHIP; MPN: 25AA080/SN; OC_FARNELL: 1816072; OC_NEWARK: 92C7351
X101 = rs41:OSC_MCU
X301 = rs41:OSC_GPS